# Altium schematic sheet 11_Photovoltaic_input.SchDoc
size 420 x 297 mm; Author: Shpakov Dmitry; Address1: Address1; Address2: Address2; Address3: Address3; Address4: Address4; DocumentNumber: АБВГ.123456.001 Э3; SheetNumber: 12; SheetTotal: 13; Scale: 1:1; DocumentType: Схема электрическая принципиальная; FirstReferrence: АБВГ.123456.001
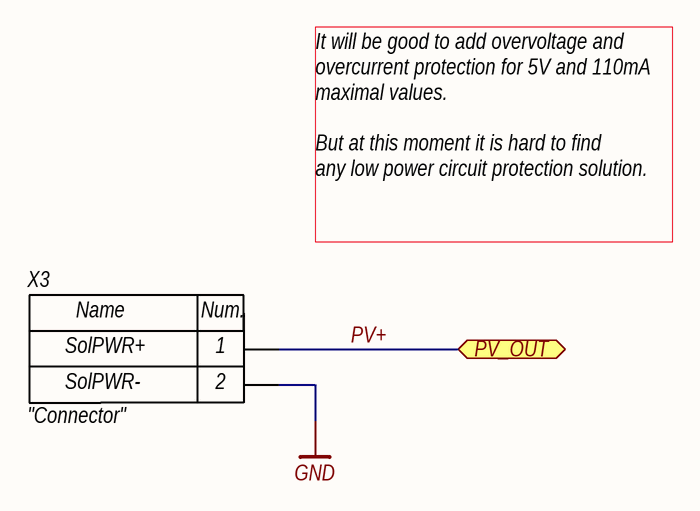
[diagram p0: 11_Photovoltaic_input.SchDoc]

## Parts
X3  "Connector"  [2-pin PCB power]

## Ports
PV_OUT

## Nets
GND: X3.2
PV+: X3.1 ; port PV_OUT

## Notes on the sheet
- It will be good to add overvoltage and
  overcurrent protection for 5V and 110mA
  maximal values.
  But at this moment it is hard to find
  any low power circuit protection solution.
- SolPWR+
- SolPWR-
- Author
- Manufacturer
- Date
- Page
- Total pages
- Size page
- A3
- Materials
- (in symbol 2-pin Power ConnectorSolderPCB) Name; Num.

## Library data of the parts
X3 = 2-pin Power ConnectorSolderPCB: Power connector. Solder on PCB.; Manufacturer: *; PartNumber: *; Help URL: *; Power/Voltage: *; Type: *; Value: *; Tolerance: *; Operation Temperature: *; Note: *; Case: *